# Altium schematic sheet MCU.SchDoc
size A4; SheetNumber: 3; SheetTotal: 8
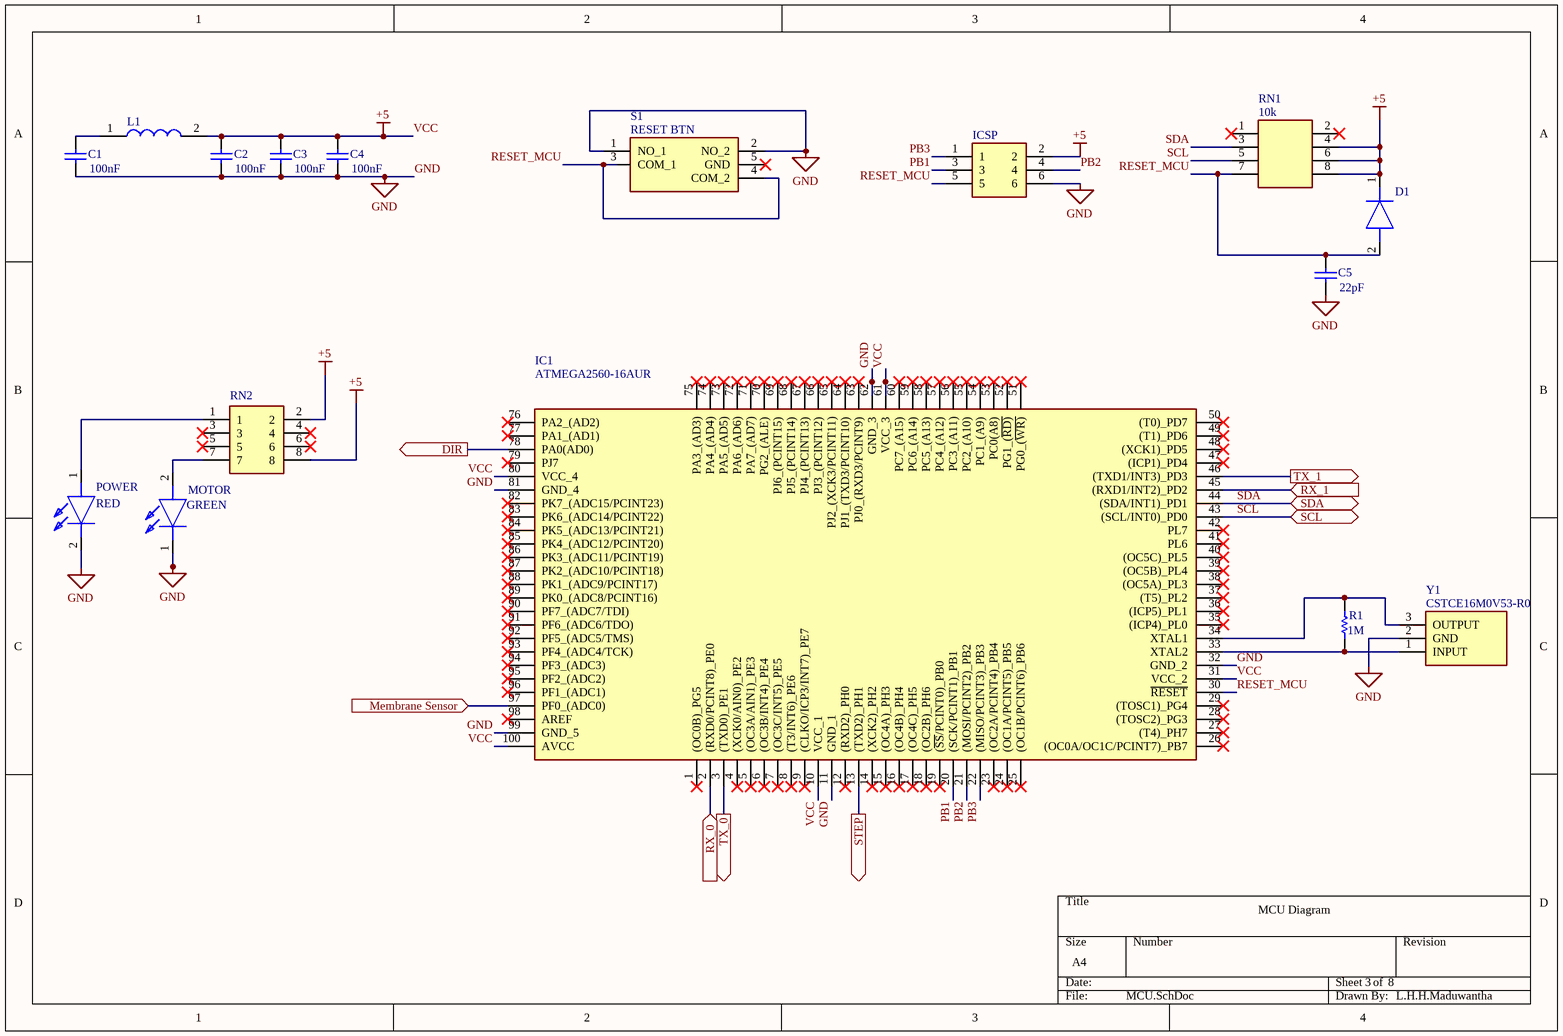
[diagram p0: MCU.SchDoc]

## Parts
C1  value 100nF  [CAPC1608X90X35LL15T15]  (hidden comment: 06035C104KAT4A)
C2  value 100nF  [CAPC1608X90X35LL15T15]  (hidden comment: 06035C104KAT4A)
C3  value 100nF  [CAPC1608X90X35LL15T15]  (hidden comment: 06035C104KAT4A)
C4  value 100nF  [CAPC1608X90X35LL15T15]  (hidden comment: 06035C104KAT4A)
C5  value 22pF  [CAPC1608X90X35NL15T15]  (hidden comment: 06035A220JAT4A)
D1  CD1206-S01575  [DIOC3215X95N]  (value not drawn)
IC1  ATMEGA2560-16AUR  [QFP50P1600X1600X120-100N]
ICSP  PH2-06-UA  [HDRV6W64P254_2X3_762X500X901P]  (value not drawn)
L1  CV201210-100K  [INDC2012X145N]  (value not drawn)
MOTOR  Color: GREEN  [LEDM2012X120N]  (hidden comment: KPT-2012SGC)
POWER  COLOR: RED  [APT2012SECKJ3PRV]  (hidden comment: APT2012SECK_J3-PRV)
R1  value 1M  [RESC1608X55X30NL15T15]  (hidden comment: ERJ-3GEYJ105V)
RN1  value 10k  [CAY16-J4]  (hidden comment: CAY16-103J4GLF)
RN2  CAY16-102J4LF  [CAY16-103J4LF]  (value not drawn)
S1  NAME: RESET BTN  [15716363]  (hidden comment: 1571636-3)
Y1  CSTCE16M0V53-R0  [CSTCE16M0V53R0]

## Ports
DIR (out, see Main[3A]), Membrane Sensor (in, see Main[2B], MembraneSensor[2B]), RX_0 (in, see Main[3B], UART_COM[2B]), RX_1 (in, see Main[3B], UART_COM[2B]), SCL (bidir, see Main[2C], PressureSensor[2C], UART_COM[2C]), SDA (bidir, see Main[2C], PressureSensor[2C], UART_COM[2C]), STEP (out, see Main[3A]), TX_0 (out, see Main[3B], UART_COM[2B]), TX_1 (out, see Main[3B], UART_COM[2B])

## Nets
GND: C1.1 C2.1 C3.1 C4.1 C5.1 IC1.11(GND_1) IC1.32(GND_2) IC1.62(GND_3) IC1.81(GND_4) IC1.99(GND_5) ICSP.6 MOTOR.1(K) POWER.2(K) S1.1(NO_1) S1.2(NO_2) Y1.2(GND)
VCC: C2.2 C3.2 C4.2 D1.1(K) IC1.10(VCC_1) IC1.31(VCC_2) IC1.61(VCC_3) IC1.80(VCC_4) IC1.100(AVCC) ICSP.2 L1.2 RN1.4 RN1.6 RN1.8 RN2.2 RN2.8  [also labelled +5]
DIR: IC1.78(PA0(AD0)) ; port DIR
Membrane Sensor: IC1.97(PF0_(ADC0)) ; port Membrane Sensor
PB1: IC1.20((SCK/PCINT1)_PB1) ICSP.3
PB2: IC1.21((MOSI/PCINT2)_PB2) ICSP.4
PB3: IC1.22((MISO/PCINT3)_PB3) ICSP.1
RESET_MCU: C5.2 D1.2(A) IC1.30(~{RESET}) ICSP.5 RN1.7 S1.3(COM_1) S1.4(COM_2)
RX_0: IC1.2((RXD0/PCINT8)_PE0) ; port RX_0
RX_1: IC1.45((RXD1/INT2)_PD2) ; port RX_1
SCL: IC1.43((SCL/INT0)_PD0) RN1.5 ; port SCL
SDA: IC1.44((SDA/INT1)_PD1) RN1.3 ; port SDA
STEP: IC1.13((TXD2)_PH1) ; port STEP
TX_0: IC1.3((TXD0)_PE1) ; port TX_0
TX_1: IC1.46((TXD1/INT3)_PD3) ; port TX_1
NetC1_2: C1.2 L1.1
NetIC1_33: IC1.33(XTAL2) R1.1 Y1.1(INPUT)
NetIC1_34: IC1.34(XTAL1) R1.2 Y1.3(OUTPUT)
NetMOTOR_2: MOTOR.2(A) RN2.7
NetPOWER_1: POWER.1(A) RN2.1

Not connected (* = marked no-connect by the designer): IC1 1((OC0B)_PG5)* 4((XCK0/AIN0)_PE2)* 5((OC3A/AIN1)_PE3)* 6((OC3B/INT4)_PE4)* 7((OC3C/INT5)_PE5)* 8((T3/INT6)_PE6)* 9((CLKO/ICP3/INT7)_PE7)* 12((RXD2)_PH0)* 14((XCK2)_PH2)* 15((OC4A)_PH3)* 16((OC4B)_PH4)* 17((OC4C)_PH5)* 18((OC2B)_PH6)* 19((~{SS}/PCINT0)_PB0)* 23((OC2A/PCINT4)_PB4)* 24((OC1A/PCINT5)_PB5)* 25((OC1B/PCINT6)_PB6)* 26((OC0A/OC1C/PCINT7)_PB7)* 27((T4)_PH7)* 28((TOSC2)_PG3)* 29((TOSC1)_PG4)* 35((ICP4)_PL0)* 36((ICP5)_PL1)* 37((T5)_PL2)* 38((OC5A)_PL3)* 39((OC5B)_PL4)* 40((OC5C)_PL5)* 41(PL6)* 42(PL7)* 47((ICP1)_PD4)* 48((XCK1)_PD5)* 49((T1)_PD6)* 50((T0)_PD7)* 51(PG0_(~{WR)})* 52(PG1_(~{RD)})* 53(PC0(A8))* 54(PC1_(A9))* 55(PC2_(A10))* 56(PC3_(A11))* 57(PC4_(A12))* 58(PC5_(A13))* 59(PC6_(A14))* 60(PC7_(A15))* 63(PJ0_(RXD3/PCINT9))* 64(PJ1_(TXD3/PCINT10))* 65(PJ2_(XCK3/PCINT11))* 66(PJ3_(PCINT12))* 67(PJ4_(PCINT13))* 68(PJ5_(PCINT14))* 69(PJ6_(PCINT15))* 70(PG2_(ALE))* 71(PA7_(AD7))* 72(PA6_(AD6))* 73(PA5_(AD5))* 74(PA4_(AD4))* 75(PA3_(AD3))* 76(PA2_(AD2))* 77(PA1_(AD1))* 79(PJ7)* 82(PK7_(ADC15/PCINT23))* 83(PK6_(ADC14/PCINT22))* 84(PK5_(ADC13/PCINT21))* 85(PK4_(ADC12/PCINT20))* 86(PK3_(ADC11/PCINT19))* 87(PK2_(ADC10/PCINT18))* 88(PK1_(ADC9/PCINT17))* 89(PK0_(ADC8/PCINT16))* 90(PF7_(ADC7/TDI))* 91(PF6_(ADC6/TDO))* 92(PF5_(ADC5/TMS))* 93(PF4_(ADC4/TCK))* 94(PF3_(ADC3))* 95(PF2_(ADC2))* 96(PF1_(ADC1))* 98(AREF)*; RN1 1* 2*; RN2 3* 4* 5* 6*; S1 5(GND)*

## Notes on the sheet
- MCU Diagram
- L.H.H.Maduwantha

## Library data of the parts
C1-C4 = CMP-2006-04390-1: Manufacturer: AVX Interconnect / Elco; Part Number: 06035C104KAT4A
C5 = CMP-2006-04271-1: Manufacturer: AVX Interconnect / Elco; Part Number: 06035A220JAT4A
D1 = CD1206-S01575: Diode; Manufacturer_Name: Bourns; Datasheet Link: https://datasheet.datasheetarchive.com/originals/distributors/SFDatasheet-7/sf-000140098.pdf; Height: 0.95mm; Manufacturer_Part_Number: CD1206-S01575; Mouser Part Number: 652-CD1206-S01575; Mouser Price/Stock: https://www.mouser.co.uk/ProductDetail/Bourns/CD1206-S01575?qs=FITO%2F%2FQgYDlGQsqciGRLTg%3D%3D; Arrow Part Number: CD1206-S01575; Arrow Price/Stock: https://www.arrow.com/en/products/cd1206-s01575/bourns
IC1 = ATMEGA2560-16AUR: Integrated Circuit; Manufacturer_Name: Microchip; Datasheet Link: http://ww1.microchip.com/downloads/en/DeviceDoc/Atmel-2549-8-bit-AVR-Microcontroller-ATmega640-1280-1281-2560-2561_datasheet.pdf; Height: 1.2mm; Manufacturer_Part_Number: ATMEGA2560-16AUR; Mouser Part Number: 556-ATMEGA2560-16AUR; Mouser Price/Stock: https://www.mouser.co.uk/ProductDetail/Microchip-Technology/ATMEGA2560-16AUR?qs=6Dg1WZIWLC5tcX5fO8xzXQ%3D%3D; Arrow Part Number: ATMEGA2560-16AUR; Arrow Price/Stock: https://www.arrow.com/en/products/atmega2560-16aur/microchip-technology?region=nac
ICSP = PH2-06-UA: Connector; Manufacturer_Name: Adam Tech; Datasheet Link: https://datasheet.datasheetarchive.com/originals/distributors/Datasheets_SAMA/c63e3fe101e7b6e3957e7ad4a1a98367.pdf; Height: 9.008mm; Manufacturer_Part_Number: PH2-06-UA; Arrow Part Number: PH2-06-UA; Arrow Price/Stock: https://www.arrow.com/en/products/ph2-06-ua/adam-tech?region=nac
L1 = CV201210-100K: Inductor; Manufacturer_Name: Bourns; Datasheet Link: https://www.bourns.com/docs/Product-Datasheets/CV201210.pdf; Height: 1.45mm; Manufacturer_Part_Number: CV201210-100K; Mouser Part Number: 652-CV201210-100K; Mouser Price/Stock: https://www.mouser.co.uk/ProductDetail/Bourns/CV201210-100K?qs=k2%252BVLg4AuuRLt64STpwovw%3D%3D; Arrow Part Number: CV201210-100K; Arrow Price/Stock: https://www.arrow.com/en/products/cv201210-100k/bourns?region=nac
MOTOR = KPT-2012SGC: LED; Manufacturer_Name: Kingbright; Datasheet Link: https://componentsearchengine.com/Datasheets/2/KPT-2012SGC.pdf; Height: 1.2mm; Manufacturer_Part_Number: KPT-2012SGC; Mouser Part Number: N/A; Mouser Price/Stock: https://www.mouser.co.uk/ProductDetail/Kingbright/KPT-2012SGC?qs=2JU0tDl2GZ3Evsz5LVxRxw%3D%3D; Arrow Part Number: KPT-2012SGC; Arrow Price/Stock: https://www.arrow.com/en/products/kpt-2012sgc/kingbright?region=europe
POWER = APT2012SECK_J3-PRV: LED; Manufacturer_Name: Kingbright; Manufacturer_Part_Number: APT2012SECK/J3-PRV; Datasheet Link: https://www.mouser.de/datasheet/2/216/APT2012SECK-J3-PRV-1173389.pdf; Height: 0.85mm; Mouser Part Number: 604-APT2012SECKJ3PRV; Mouser Price/Stock: https://www.mouser.co.uk/ProductDetail/Kingbright/APT2012SECK-J3-PRV?qs=D2TOvUWgdJ6T9J6WfI%252BQOg%3D%3D; Arrow Part Number: APT2012SECK/J3-PRV; Arrow Price/Stock: https://www.arrow.com/en/products/apt2012seckj3-prv/kingbright?region=nac
R1 = CMP-2000-00706-1: Manufacturer: Panasonic; Part Number: ERJ-3GEYJ105V
RN1 = CAY16-103J4GLF: Resistor Network; Manufacturer_Name: Bourns; Datasheet Link: http://www.bourns.com/docs/Product-Datasheets/CATCAY.pdf; Manufacturer_Part_Number: CAY16-103J4GLF; Mouser Part Number: 652-CAY16-103J4GLF; Mouser Price/Stock: https://www.mouser.co.uk/ProductDetail/Bourns/CAY16-103J4GLF?qs=ehdiChDUEdVKSWacpiiZig%3D%3D; Arrow Part Number: CAY16-103J4GLF; Arrow Price/Stock: https://www.arrow.com/en/products/cay16-103j4glf/bourns
RN2 = CAY16-102J4LF: Resistor Network; Manufacturer_Name: Bourns; Datasheet Link: http://www.bourns.com/docs/Product-Datasheets/CATCAY.pdf; Manufacturer_Part_Number: CAY16-102J4LF; Mouser Part Number: 652-CAY16-102J4LF; Mouser Price/Stock: https://www.mouser.co.uk/ProductDetail/Bourns/CAY16-102J4LF?qs=LCMWAU1DZcxTp%252BoNHGBb3Q%3D%3D; Arrow Part Number: CAY16-102J4LF; Arrow Price/Stock: https://www.arrow.com/en/products/cay16-102j4lf/bourns?region=europe
S1 = 1571636-3: Switch; Manufacturer_Name: TE Connectivity; Datasheet Link: https://www.mouser.com/datasheet/2/418/NG_CD_1571636_C2-652439.pdf; Height: 2.5mm; Manufacturer_Part_Number: 1571636-3; Mouser Part Number: 506-1571636-3; Mouser Price/Stock: https://www.mouser.co.uk/ProductDetail/TE-Connectivity-Alcoswitch/1571636-3?qs=9qK3lZr%252Bi0Iiy0ZiPH8Cfg%3D%3D
Y1 = CSTCE16M0V53-R0: Crystal or Oscillator; Manufacturer_Name: Murata Electronics; Value: 16MHz; Datasheet Link: https://www.murata.com/en-sg/products/productdetail?partno=CSTCE16M0V53-R0; Height: 1mm; Manufacturer_Part_Number: CSTCE16M0V53-R0; Mouser Part Number: 81-CSTCE16M0V53-R0; Mouser Price/Stock: https://www.mouser.co.uk/ProductDetail/Murata-Electronics/CSTCE16M0V53-R0?qs=HPA2Xx%252BU0WhPWbRcNuzhZw%3D%3D